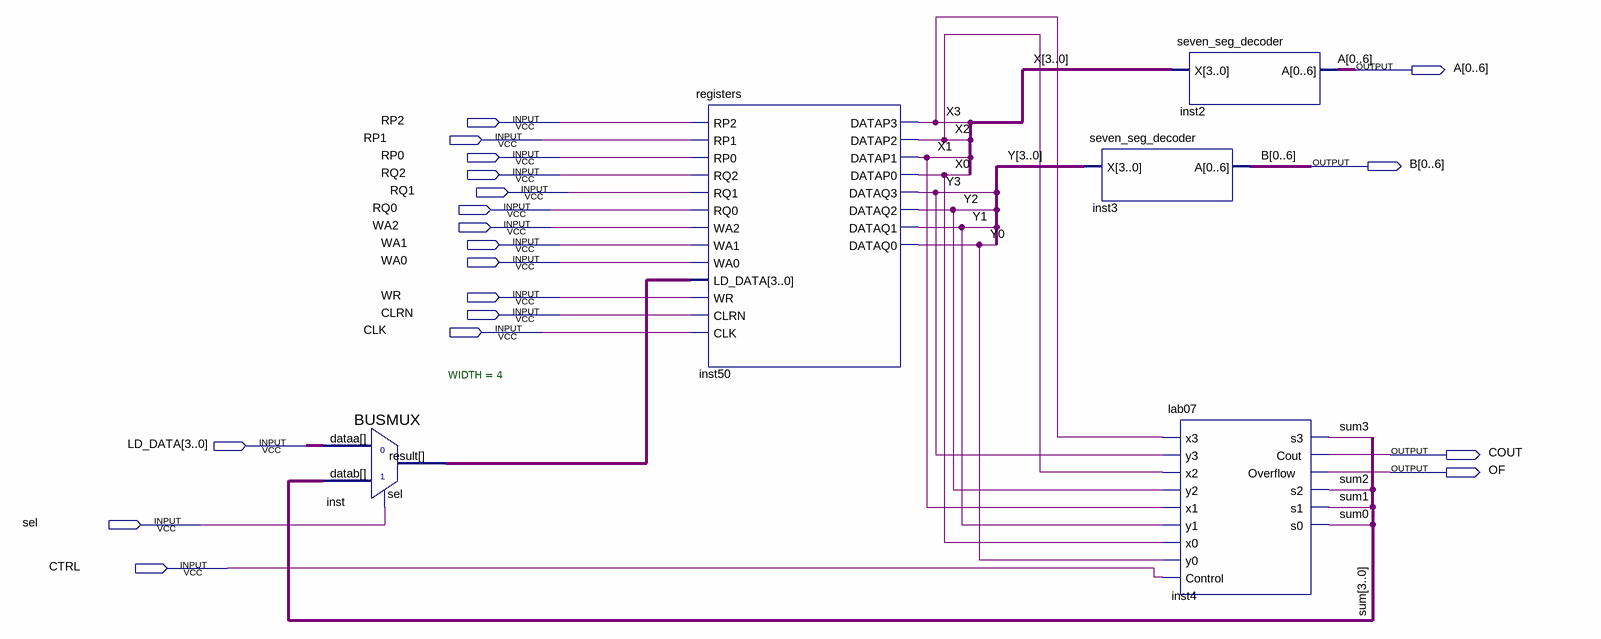
[diagram p0: schematic sheet]
// Quartus schematic lab12step3.bdf as structural Verilog: 5 symbols, 19 pins
module lab12step3 (
  input  RP2,
  input  RP1,
  input  RP0,
  input  RQ2,
  input  RQ1,
  input  RQ0,
  input  WA2,
  input  WA1,
  input  WA0,
  input  WR,
  input  CLRN,
  input  CLK,
  input  [3:0] LD_DATA,
  input  sel,
  input  CTRL,
  output [0:6] A,
  output [0:6] B,
  output COUT,
  output OF
);

  wire [3:0] inst_result, sum, X, Y;

  BUSMUX #(.WIDTH(4)) inst (.datab(sum), .sel(sel), .dataa(LD_DATA), .result(inst_result));
  registers inst50 (
    .RP2(RP2), .RP1(RP1), .RP0(RP0), .RQ2(RQ2), .RQ1(RQ1), .RQ0(RQ0), .WA2(WA2), .WA1(WA1), .WA0(WA0),
    .LD_DATA(inst_result), .WR(WR), .CLRN(CLRN), .CLK(CLK), .DATAP3(X[3]), .DATAP2(X[2]), .DATAP1(X[1]),
    .DATAP0(X[0]), .DATAQ3(Y[3]), .DATAQ2(Y[2]), .DATAQ1(Y[1]), .DATAQ0(Y[0]));
  seven_seg_decoder inst3 (.X(Y), .A(B));
  seven_seg_decoder inst2 (.X(X), .A(A));
  lab07 inst4 (
    .x3(X[3]), .y3(Y[3]), .x2(X[2]), .y2(Y[2]), .x1(X[1]), .y1(Y[1]), .x0(X[0]), .y0(Y[0]), .Control(CTRL),
    .s3(sum[3]), .Cout(COUT), .Overflow(OF), .s2(sum[2]), .s1(sum[1]), .s0(sum[0]));
endmodule
